# Altium project MAX3738ETG+ MEZ.PrjPCB
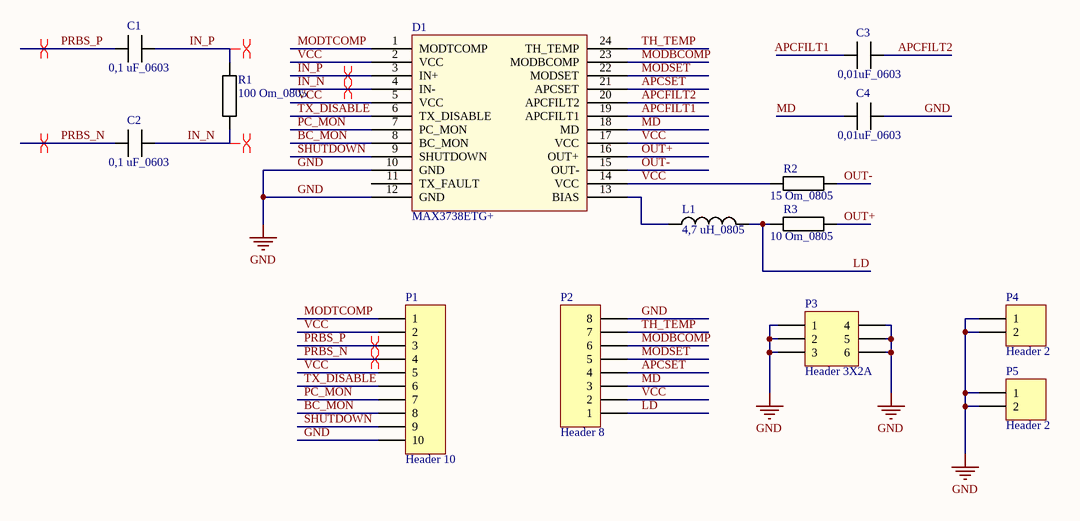
[diagram p0: MAX3738ETG+ MEZ.SchDoc]
1 sheet, 14 parts. Net scope: global (net labels, ports and power ports of the same name join across sheets).
Board file: MAX3738ETG+ MEZ.PcbDoc

## Sheet MAX3738ETG+ MEZ.SchDoc
size A3; Address1: Address1; Address2: Address2; Address3: Address3; Address4: Address4; DocumentNumber: АБВГ.123456.001 Э3; SheetNumber: 1; Scale: 1:1; DocumentType: Схема электрическая принципиальная; FirstReferrence: АБВГ.123456.001

### Parts
C1  0,1 uF_0603  [CAP_0603]
C2  0,1 uF_0603  [CAP_0603]
C3  0,01uF_0603  [CAP_0603]
C4  0,01uF_0603  [CAP_0603]
D1  MAX3738ETG+  [MAX3738ETG+]
L1  4,7 uH_0805  [IND_0805]
P1  Header 10  [HDR1X10]
P2  Header 8  [HDR1X8]
P3  Header 3X2A  [HDR2X3_CEN]
P4  Header 2  [HDR1X2]
P5  Header 2  [HDR1X2]
R1  100 Om_0805  [RES_0805]
R2  15 Om_0805  [RES_0805]
R3  10 Om_0805  [RES_0805]

### Nets
GND: C4.2 D1.10(GND) D1.12(GND) P1.10 P2.8 P3.1 P3.2 P3.3 P3.4 P3.5 P3.6 P4.1 P4.2 P5.1 P5.2
APCFILT1: C3.1 D1.19(APCFILT1)
APCFILT2: C3.2 D1.20(APCFILT2)
APCSET: D1.21(APCSET) P2.4
BC_MON: D1.8(BC_MON) P1.8
IN_N: C2.2 D1.4(IN-) R1.1
IN_P: C1.2 D1.3(IN+) R1.2
LD: L1.2 P2.1 R3.1
MD: C4.1 D1.18(MD) P2.3
MODBCOMP: D1.23(MODBCOMP) P2.6
MODSET: D1.22(MODSET) P2.5
MODTCOMP: D1.1(MODTCOMP) P1.1
OUT+: D1.16(OUT+) R3.2
OUT-: D1.15(OUT-) R2.2
PC_MON: D1.7(PC_MON) P1.7
PRBS_N: C2.1 P1.4
PRBS_P: C1.1 P1.3
SHUTDOWN: D1.9(SHUTDOWN) P1.9
TH_TEMP: D1.24(TH_TEMP) P2.7
TX_DISABLE: D1.6(TX_DISABLE) P1.6
VCC: D1.2(VCC) D1.5(VCC) D1.14(VCC) D1.17(VCC) P1.2 P1.5 P2.2 R2.1
NetD1_13: D1.13(BIAS) L1.1

Not connected (* = marked no-connect by the designer): D1 11(TX_FAULT)

### Layout directives
differential pair: IN_N, IN_P, PRBS_N, PRBS_P

### Notes on the sheet
- Title
- Size:
- Date:
- A3
- Number:
- Time:
- Revision:
- Sheet
- of
- File:

### Library data of the parts
C1-C4 = CAP
L1 = IND
P1 = Header 10: Header, 10-Pin; LatestRevisionDate: 17-Jul-2002; LatestRevisionNote: Re-released for DXP Platform.; Publisher: Altium Limited
P2 = Header 8: Header, 8-Pin; LatestRevisionDate: 17-Jul-2002; LatestRevisionNote: Re-released for DXP Platform.; Publisher: Altium Limited
P3 = Header 3X2A: Header, 3-Pin, Dual row; LatestRevisionDate: 17-Jul-2002; LatestRevisionNote: Re-released for DXP Platform.; Publisher: Altium Limited
P4 P5 = Header 2: Header, 2-Pin; LatestRevisionDate: 17-Jul-2002; LatestRevisionNote: Re-released for DXP Platform.; Publisher: Altium Limited
R1-R3 = RES